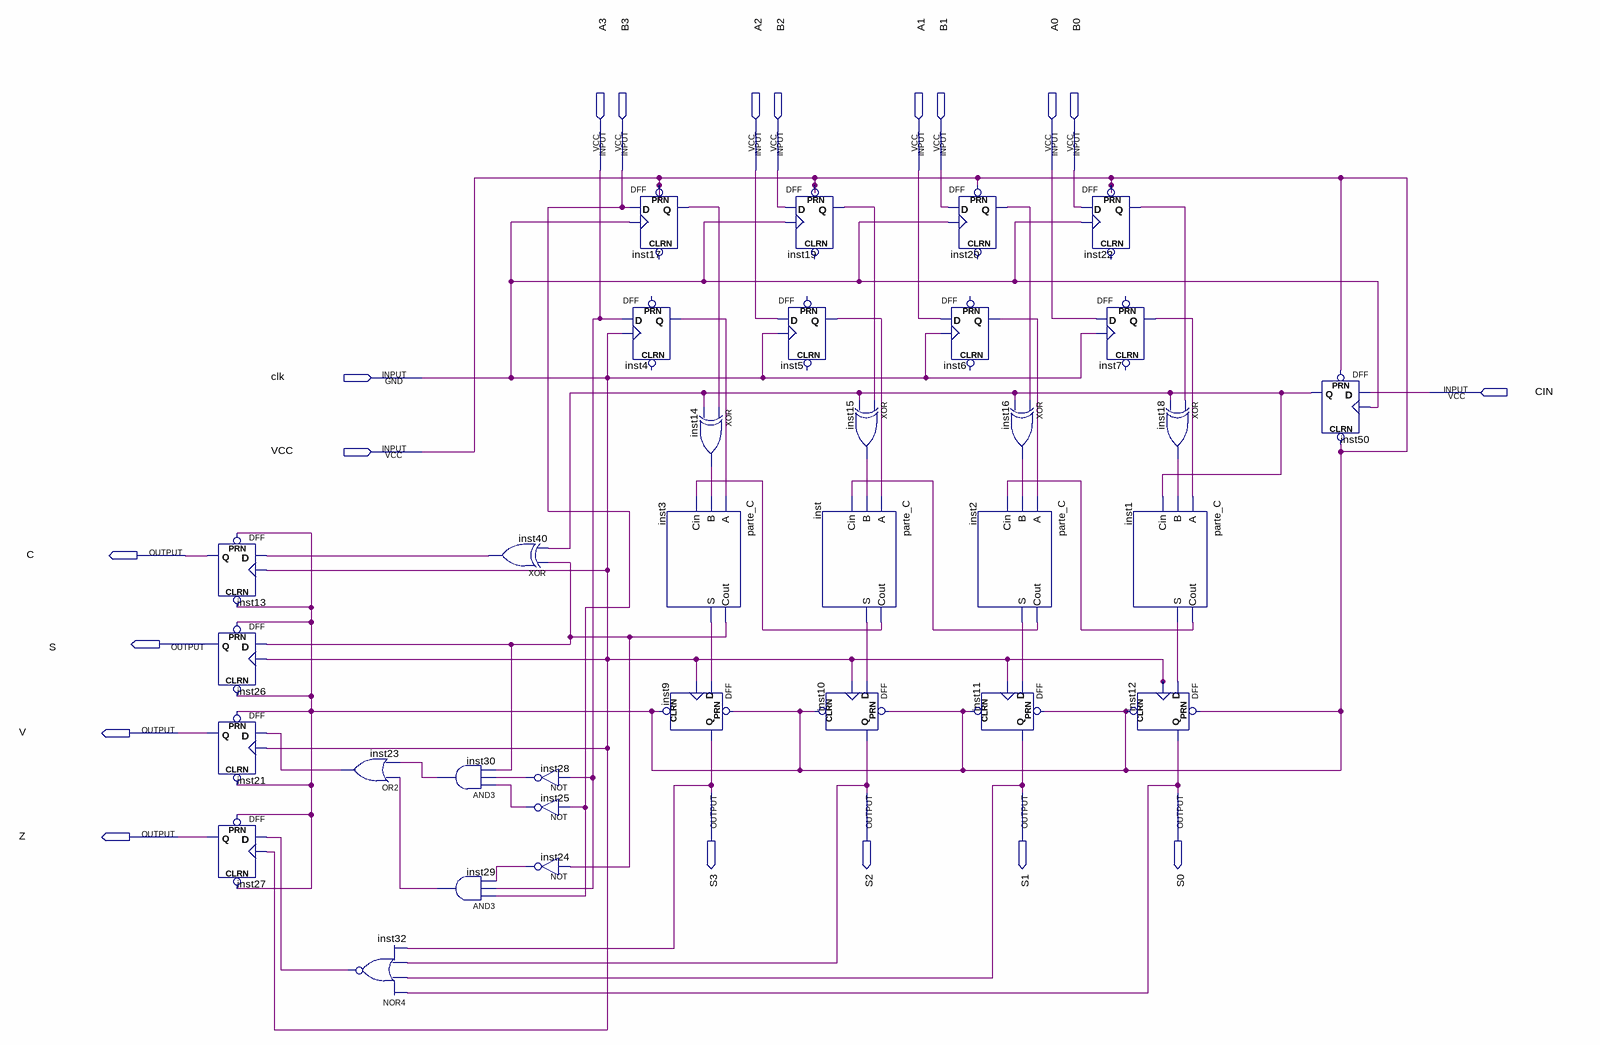
[diagram p0: schematic sheet]
// Quartus schematic PARTE_C_DIAGRAMA.bdf as structural Verilog: 33 symbols, 19 pins
module PARTE_C_DIAGRAMA (
  input  A3,
  input  B3,
  input  A2,
  input  B2,
  input  A1,
  input  B1,
  input  A0,
  input  B0,
  input  clk,
  input  CIN,
  input  VCC,
  output C,
  output S,
  output V,
  output S3,
  output S2,
  output S1,
  output S0,
  output Z
);

  wire inst1_cout, inst1_s, inst2_cout, inst2_s, inst3_cout, inst3_s, inst4_q, inst5_q, inst6_q, inst7_q,
       inst14_out, inst15_out, inst16_out, inst17_q, inst18_out, inst19_q, inst20_q, inst22_q, inst23_out,
       inst24_out, inst25_out, inst28_out, inst29_out, inst30_out, inst32_out, inst40_out, inst50_q,
       inst_cout, inst_s;

  DFF inst13 (.CLRN(VCC), .CLK(clk), .D(inst40_out), .PRN(VCC), .Q(C));
  DFF inst26 (.CLRN(VCC), .CLK(clk), .D(inst3_cout), .PRN(VCC), .Q(S));
  DFF inst21 (.CLRN(VCC), .CLK(clk), .D(inst23_out), .PRN(VCC), .Q(V));
  DFF inst27 (.CLRN(VCC), .CLK(clk), .D(inst32_out), .PRN(VCC), .Q(Z));
  or inst23 (inst23_out, inst29_out, inst30_out);
  nor inst32 (inst32_out, S0, S1, S2, S3);
  and inst30 (inst30_out, inst25_out, inst28_out, inst3_cout);
  and inst29 (inst29_out, B3, A3, inst24_out);
  xor inst40 (inst40_out, inst3_cout, inst50_q);
  not inst28 (inst28_out, A3);
  not inst25 (inst25_out, B3);
  not inst24 (inst24_out, inst3_cout);
  DFF inst17 (.CLK(clk), .D(B3), .PRN(VCC), .Q(inst17_q));  // open: CLRN
  DFF inst4 (.CLK(clk), .D(A3), .Q(inst4_q));  // open: CLRN, PRN
  xor inst14 (inst14_out, inst17_q, inst50_q);
  parte_C inst3 (.A(inst4_q), .B(inst14_out), .Cin(inst_cout), .Cout(inst3_cout), .S(inst3_s));
  DFF inst9 (.CLRN(VCC), .CLK(clk), .D(inst3_s), .PRN(VCC), .Q(S3));
  DFF inst19 (.CLK(clk), .D(B2), .PRN(VCC), .Q(inst19_q));  // open: CLRN
  DFF inst5 (.CLK(clk), .D(A2), .Q(inst5_q));  // open: CLRN, PRN
  parte_C inst (.A(inst5_q), .B(inst15_out), .Cin(inst2_cout), .Cout(inst_cout), .S(inst_s));
  DFF inst10 (.CLRN(VCC), .CLK(clk), .D(inst_s), .PRN(VCC), .Q(S2));
  xor inst15 (inst15_out, inst19_q, inst50_q);
  DFF inst20 (.CLK(clk), .D(B1), .PRN(VCC), .Q(inst20_q));  // open: CLRN
  DFF inst6 (.CLK(clk), .D(A1), .Q(inst6_q));  // open: CLRN, PRN
  parte_C inst2 (.A(inst6_q), .B(inst16_out), .Cin(inst1_cout), .Cout(inst2_cout), .S(inst2_s));
  DFF inst11 (.CLRN(VCC), .CLK(clk), .D(inst2_s), .PRN(VCC), .Q(S1));
  xor inst16 (inst16_out, inst20_q, inst50_q);
  DFF inst22 (.CLK(clk), .D(B0), .PRN(VCC), .Q(inst22_q));  // open: CLRN
  DFF inst7 (.CLK(clk), .D(A0), .Q(inst7_q));  // open: CLRN, PRN
  xor inst18 (inst18_out, inst22_q, inst50_q);
  parte_C inst1 (.A(inst7_q), .B(inst18_out), .Cin(inst50_q), .Cout(inst1_cout), .S(inst1_s));
  DFF inst12 (.CLRN(VCC), .CLK(clk), .D(inst1_s), .PRN(VCC), .Q(S0));
  DFF inst50 (.CLRN(VCC), .CLK(clk), .D(CIN), .PRN(VCC), .Q(inst50_q));
endmodule
